# EAGLE design StasDuino_V2 (EAGLE 9.5.2)
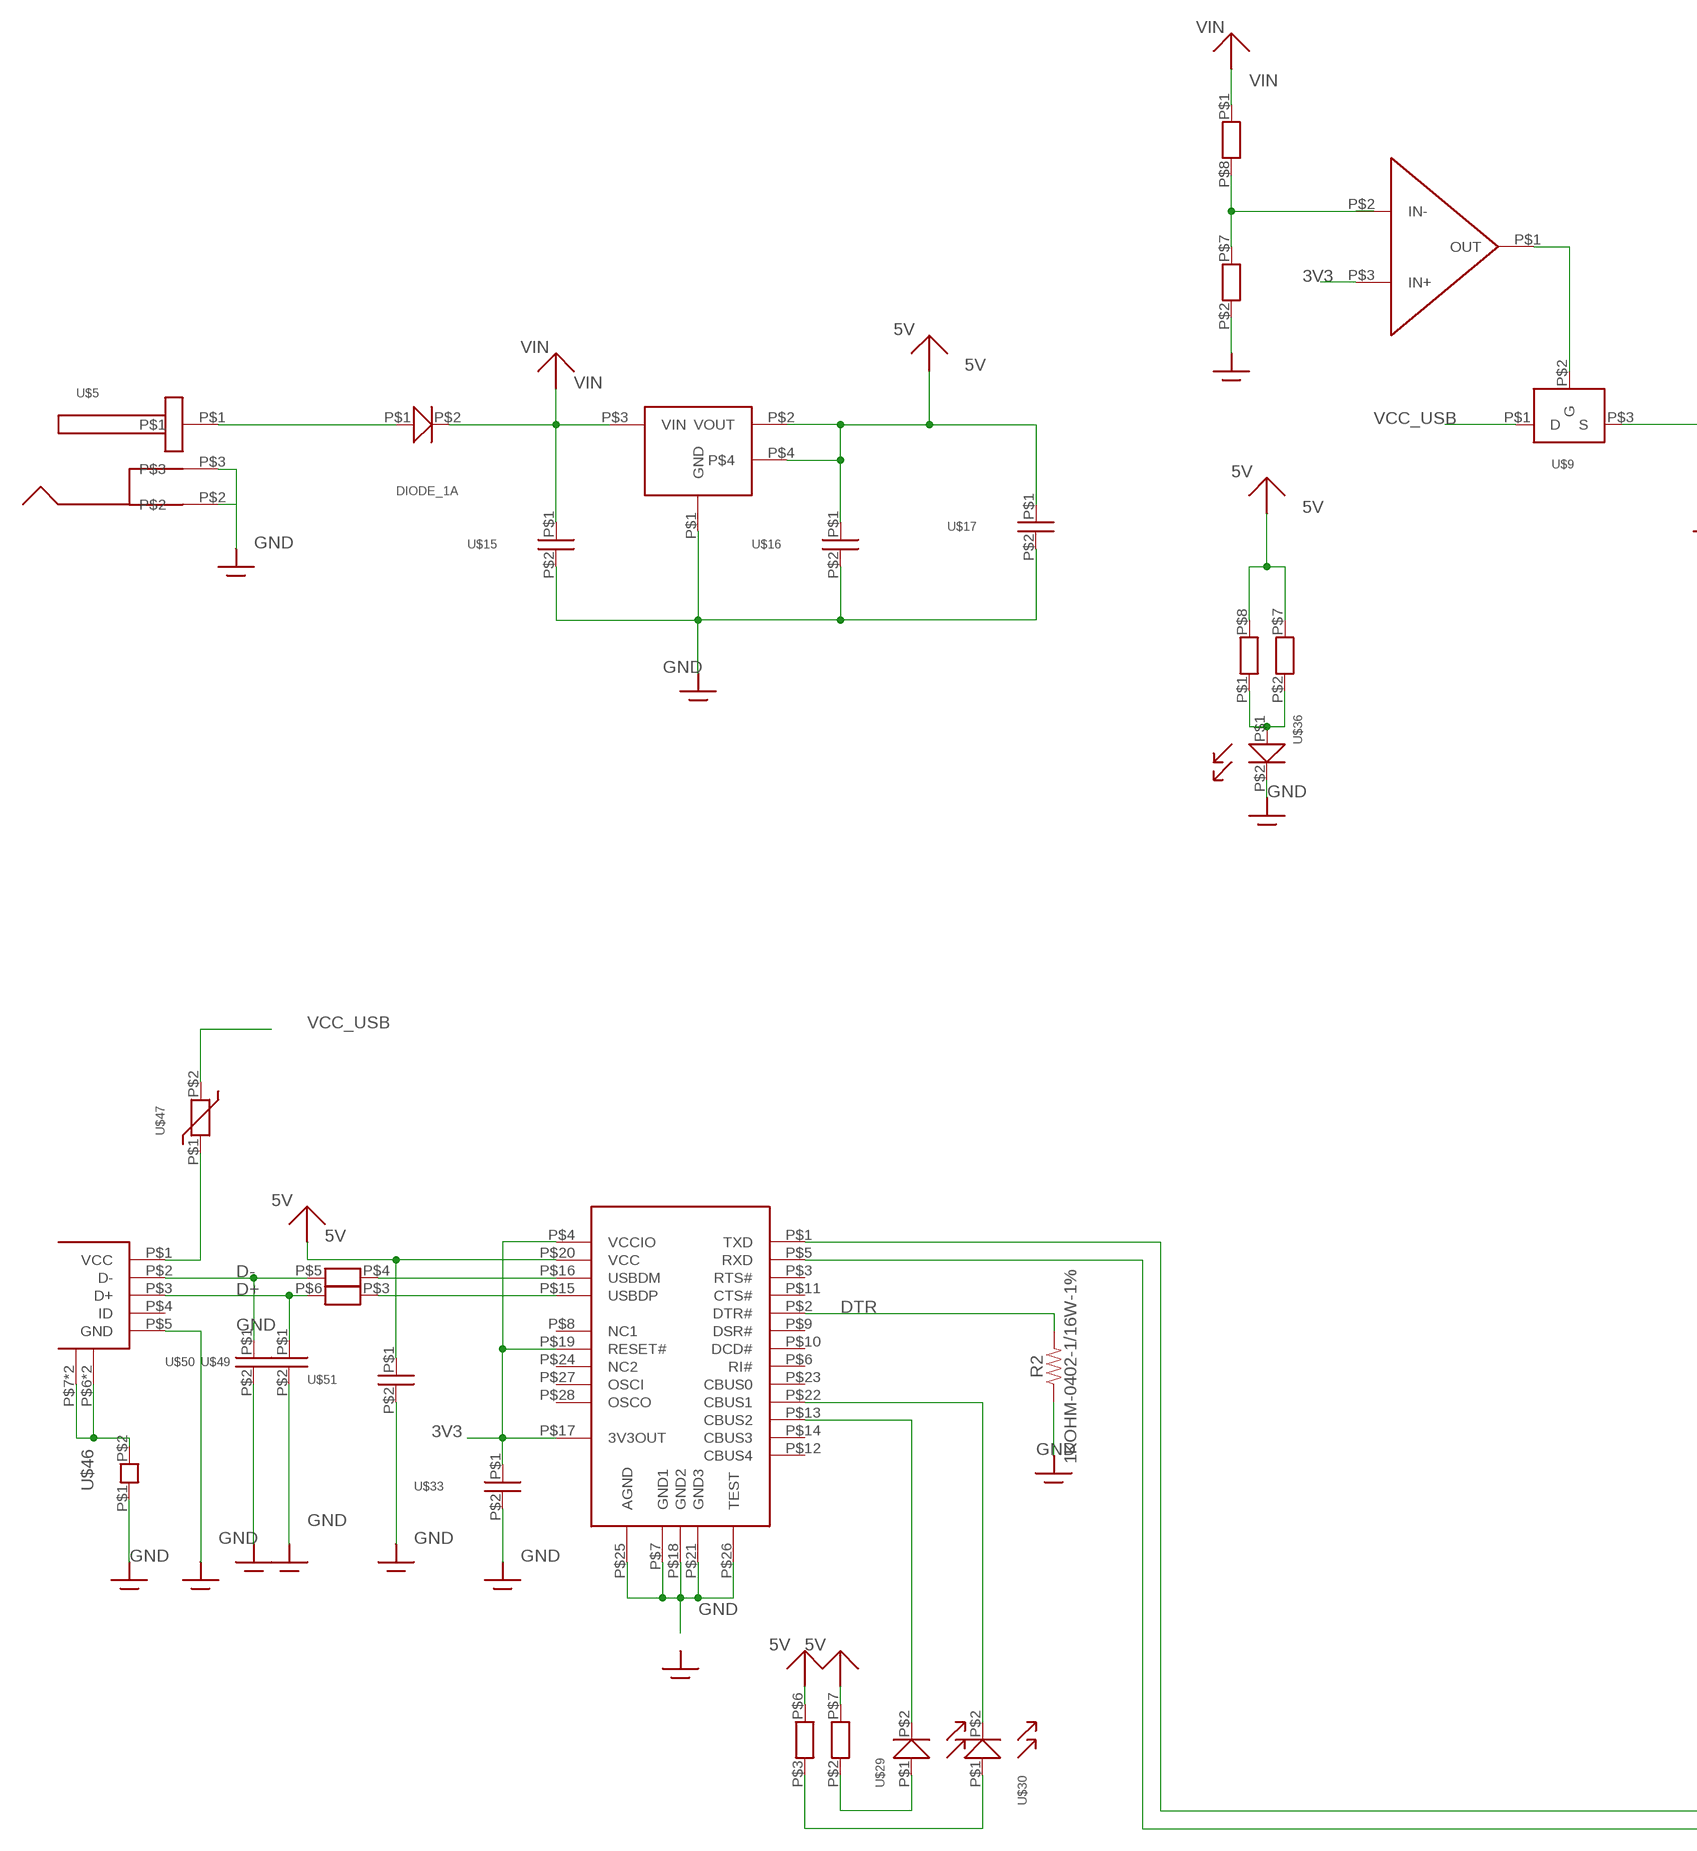
[diagram p0: schematic, sheet 1, part 1 of 2]
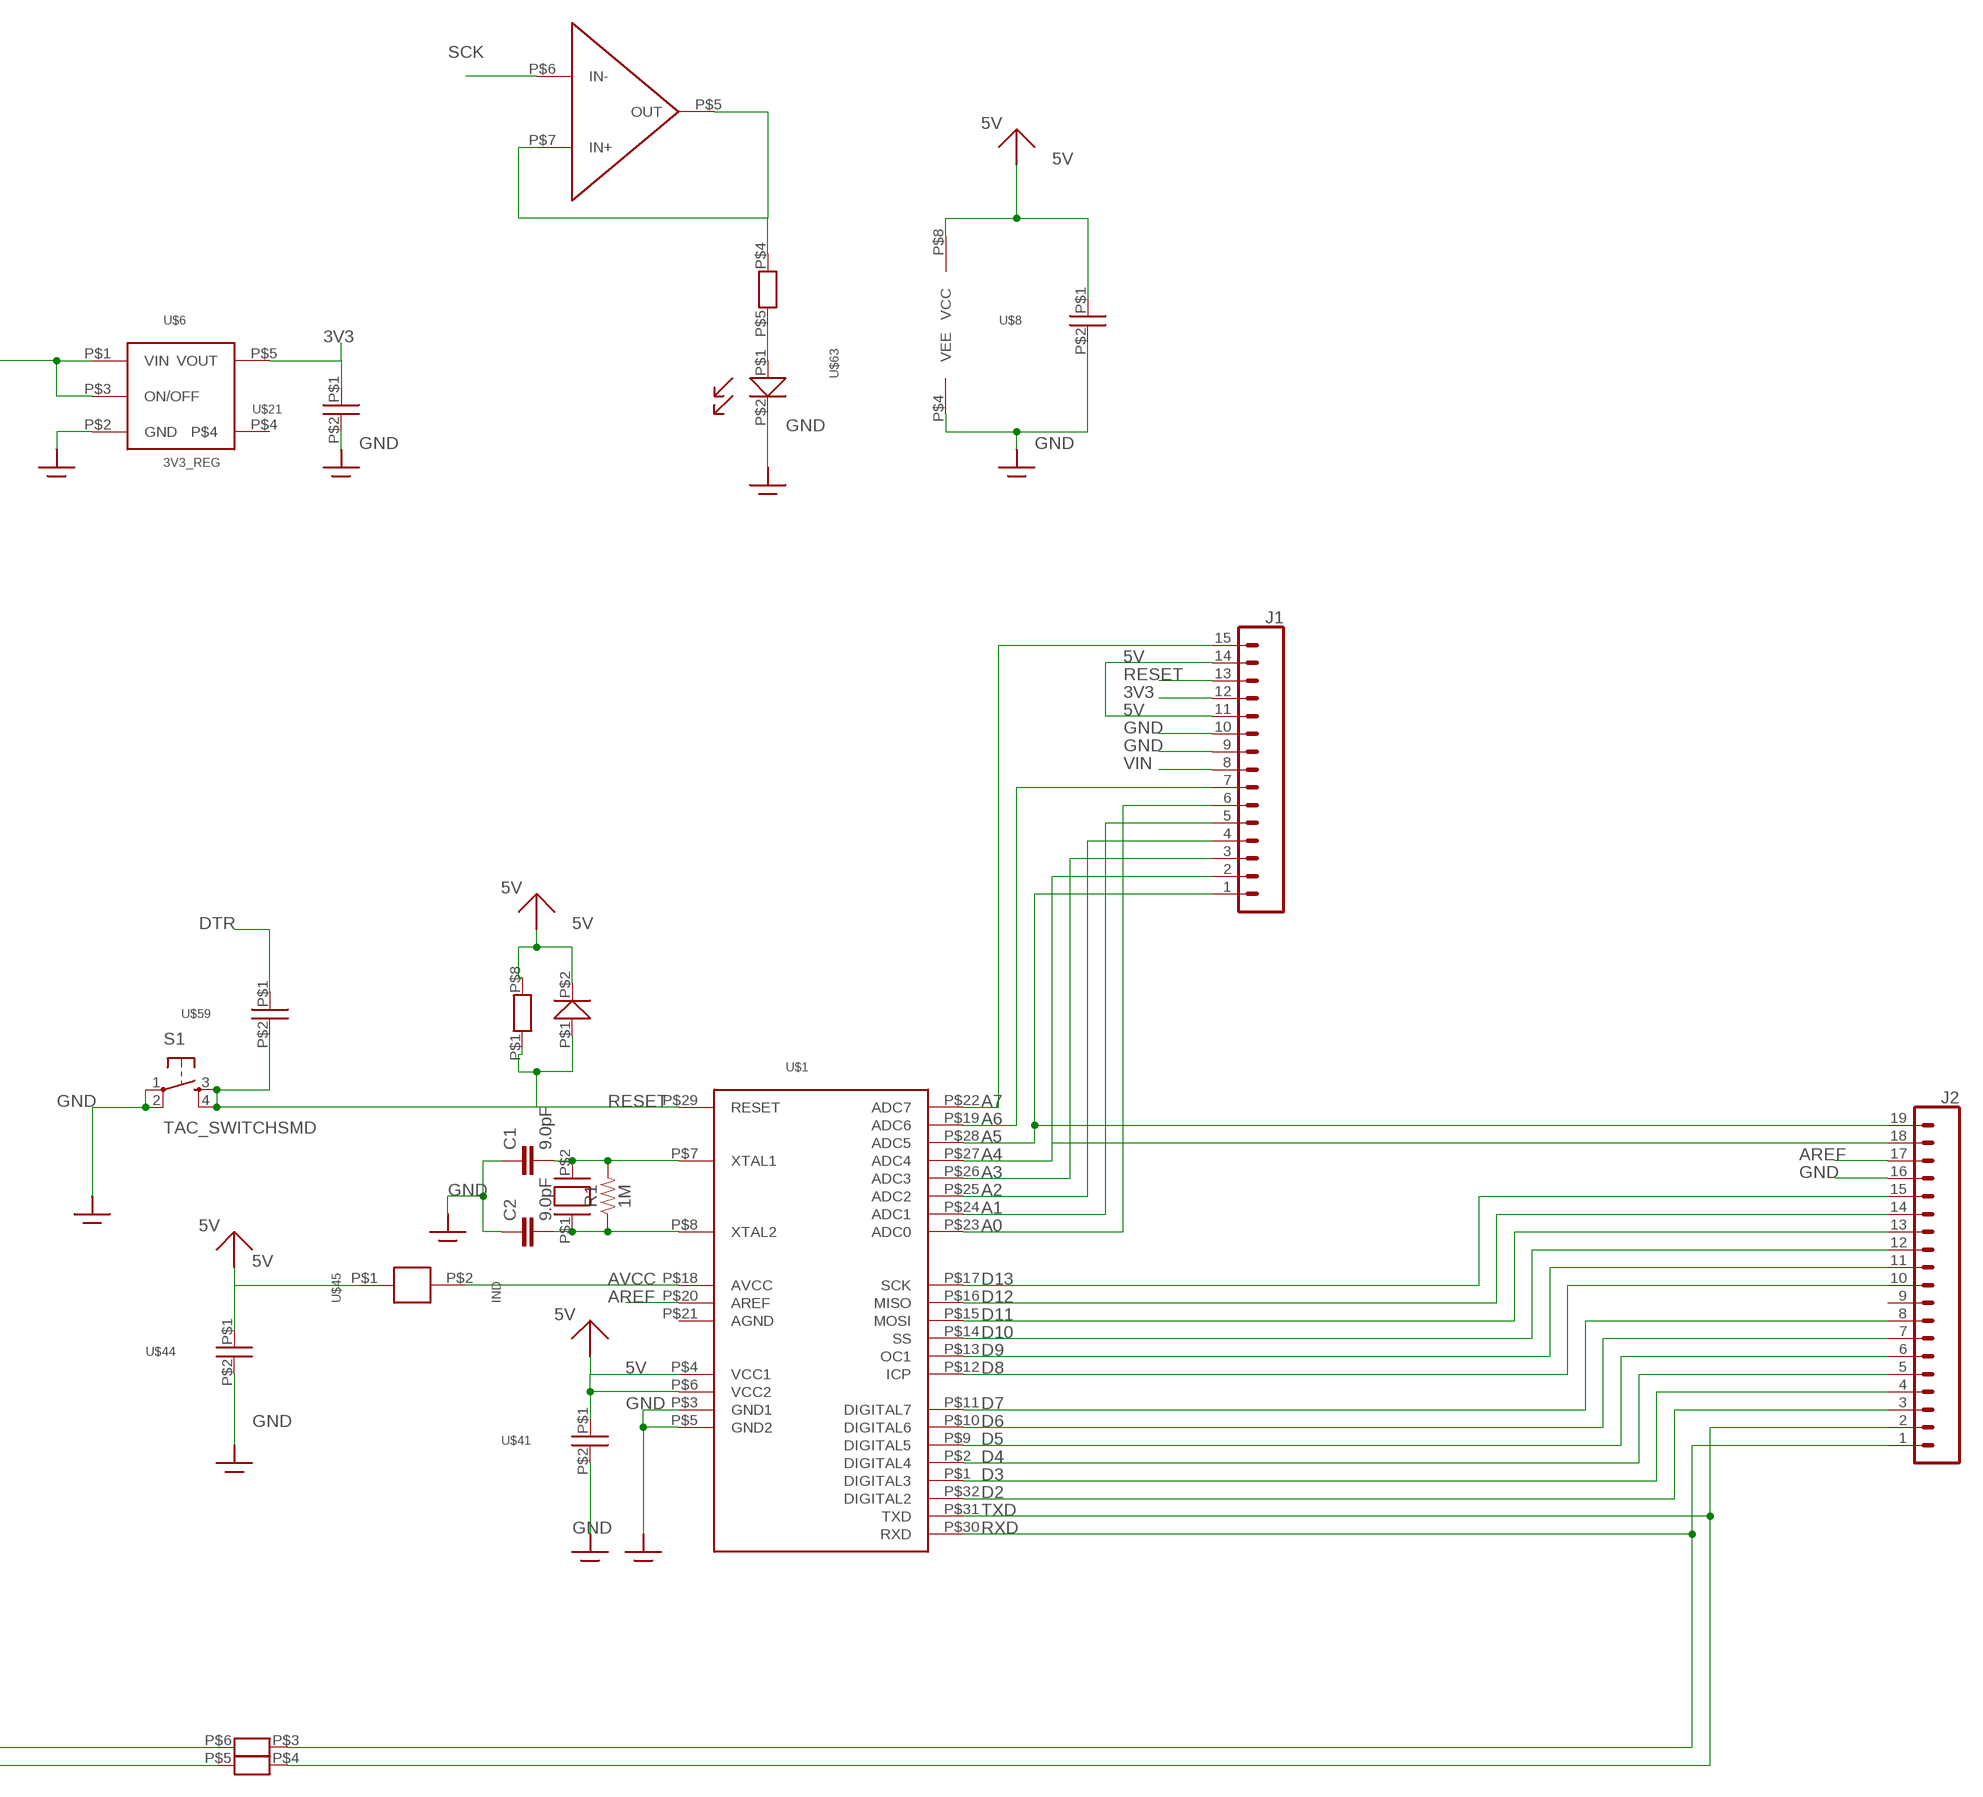
[diagram p1: schematic, sheet 1, part 2 of 2]

## Parts
C1  9.0pF  9.0PF-0603-50V-10%  [0603]
C2  9.0pF  9.0PF-0603-50V-10%  [0603]
J1  CONN_15  [1X15]
J2  CONN_19  [1X19]
R1  1M  1MOHM-0603-1/4W-5%  [0603]
R2  1KOHM-0402-1/16W-1%  [0402]
S1  TAC_SWITCHSMD  [TACTILE-SWITCH-SMD]
U$1  ATMEGA328P_TQFP  [ATMEGA328P_TQFP]
U$2  FTDI_SERIAL  [FTDI_SERIAL]
U$3  USB_MICRO  [USB_MICRO]
U$4  5V_REG  [5V_REG]
U$5  DC_POWERJACK  [DC_POWERJACK]
U$6  3V3_REG  [3V3_REG]
U$7  OPAMP  [OPAMP]
U$8  CAP_0805  [CAP_0805]
U$9  PMOS  [PMOS]
U$12  DIODE_1A  [DIODE_1A]
U$15  CAP_0805  [CAP_0805]
U$16  CAP_0805  [CAP_0805]
U$17  CAP_0805  [CAP_0805]
U$20  RES_ARRAY  [RES_ARRAY]
U$21  CAP_0805  [CAP_0805]
U$29  LED_0805  [LED_0805]
U$30  LED_0805  [LED_0805]
U$33  CAP_0805  [CAP_0805]
U$34  RES_ARRAY  [RES_ARRAY]
U$36  LED_0805  [LED_0805]
U$41  CAP_0805  [CAP_0805]
U$44  CAP_0805  [CAP_0805]
U$45  IND  [IND]
U$46  FERRITE_BEAD  [FERRITE_BEAD]
U$47  RESET_FUSE  [RESET_FUSE]
U$48  RES_ARRAY  [RES_ARRAY]
U$49  CAP_0805  [CAP_0805]
U$50  CAP_0805  [CAP_0805]
U$51  CAP_0805  [CAP_0805]
U$57  CRYSTAL  [CRYSTAL]
U$59  CAP_0805  [CAP_0805]
U$60  DIODE  [DIODE]
U$63  LED_0805  [LED_0805]

## Nets
3V3: J1.12 U$2.P$4(VCCIO) U$2.P$17(3V3OUT) U$2.P$19(RESET#) U$6.P$5(VOUT) U$7.P$3(IN+) U$21.P$1 U$33.P$1
5V: J1.11 J1.14 U$1.P$4(VCC1) U$1.P$6(VCC2) U$2.P$20(VCC) U$4.P$2(VOUT) U$4.P$4 U$7.P$8(VCC) U$8.P$1 U$16.P$1 U$17.P$1 U$34.P$7 U$34.P$8 U$41.P$1 U$44.P$1 U$45.P$1 U$48.P$6 U$48.P$7 U$48.P$8 U$51.P$1 U$60.P$2
A0: J1.6 U$1.P$23(ADC0)
A1: J1.5 U$1.P$24(ADC1)
A2: J1.4 U$1.P$25(ADC2)
A3: J1.3 U$1.P$26(ADC3)
A4: J1.2 J2.18 U$1.P$27(ADC4)
A5: J1.1 J2.19 U$1.P$28(ADC5)
A6: J1.7 U$1.P$19(ADC6)
A7: J1.15 U$1.P$22(ADC7)
AREF: J2.17 U$1.P$20(AREF)
AVCC: U$1.P$18(AVCC) U$45.P$2
D2: J2.3 U$1.P$32(DIGITAL2)
D3: J2.4 U$1.P$1(DIGITAL3)
D4: J2.5 U$1.P$2(DIGITAL4)
D5: J2.6 U$1.P$9(DIGITAL5)
D6: J2.7 U$1.P$10(DIGITAL6)
D7: J2.8 U$1.P$11(DIGITAL7)
D8: J2.10 U$1.P$12(ICP)
D9: J2.11 U$1.P$13(OC1)
D10: J2.12 U$1.P$14(SS)
D11: J2.13 U$1.P$15(MOSI)
D12: J2.14 U$1.P$16(MISO)
D13: J2.15 U$1.P$17(SCK)
D+: U$3.P$3(D+) U$20.P$6 U$49.P$1
D-: U$3.P$2(D-) U$20.P$5 U$50.P$1
DTR: R2.2 U$2.P$2(DTR#) U$59.P$1
GND: C1.1 C2.1 J1.9 J1.10 J2.16 R2.1 S1.1 S1.2 U$1.P$3(GND1) U$1.P$5(GND2) U$2.P$7(GND1) U$2.P$18(GND2) U$2.P$21(GND3) U$2.P$25(AGND) U$2.P$26(TEST) U$3.P$5(GND) U$4.P$1(GND) U$5.P$2 U$5.P$3 U$6.P$2(GND) U$7.P$4(VEE) U$8.P$2 U$15.P$2 U$16.P$2 U$17.P$2 U$20.P$2 U$21.P$2 U$33.P$2 U$36.P$2 U$41.P$2 U$44.P$2 U$46.P$1 U$49.P$2 U$50.P$2 U$51.P$2 U$63.P$2
N$1: C1.2 R1.2 U$1.P$7(XTAL1) U$57.P$2
N$2: U$5.P$1 U$12.P$1
N$3: U$3.P$6(SHIELD1) U$3.P$7(SHIELD2) U$3.P$8(SHIELD1) U$3.P$9(SHIELD2) U$46.P$2
N$4: C2.2 R1.1 U$1.P$8(XTAL2) U$57.P$1
N$5: U$7.P$2(IN-) U$20.P$7 U$20.P$8
N$6: U$7.P$1(OUT) U$9.P$2(G)
N$7: U$29.P$1 U$48.P$2
N$8: U$6.P$1(VIN) U$6.P$3(ON/OFF) U$9.P$3(S)
N$9: U$30.P$1 U$48.P$3
N$10: U$48.P$5 U$63.P$1
N$11: U$2.P$15(USBDP) U$20.P$3
N$12: U$2.P$5(RXD) U$34.P$5
N$13: U$2.P$1(TXD) U$34.P$6
N$14: U$2.P$22(CBUS1) U$30.P$2
N$15: U$2.P$16(USBDM) U$20.P$4
N$16: U$2.P$13(CBUS2) U$29.P$2
N$24: U$34.P$1 U$34.P$2 U$36.P$1
N$32: U$3.P$1(VCC) U$47.P$1
N$60: U$7.P$5(OUT) U$7.P$7(IN+) U$48.P$4
RESET: J1.13 S1.3 S1.4 U$1.P$29(RESET) U$48.P$1 U$59.P$2 U$60.P$1
RXD: J2.1 U$1.P$30(RXD) U$34.P$3
SCK: U$7.P$6(IN-)
TXD: J2.2 U$1.P$31(TXD) U$34.P$4
VCC_USB: U$9.P$1(D) U$47.P$2
VIN: J1.8 U$4.P$3(VIN) U$12.P$2 U$15.P$1 U$20.P$1
Unconnected: J2.9 U$1.P$21(AGND) U$2.P$3(RTS#) U$2.P$6(RI#) U$2.P$8(NC1) U$2.P$9(DSR#) U$2.P$10(DCD#) U$2.P$11(CTS#) U$2.P$12(CBUS4) U$2.P$14(CBUS3) U$2.P$23(CBUS0) U$2.P$24(NC2) U$2.P$27(OSCI) U$2.P$28(OSCO) U$3.P$4(ID) U$6.P$4

## Library data of the parts
C1 C2 = StasDuinoLib2:9.0PF: 9.0pF ceramic capacitors A capacitor is a passive two-terminal electrical component used to store electrical energy temporarily in an electric field.; PROD_ID: CAP-09341
J1 = StasDuinoLib2:CONN_15: Multi connection point. Often used as Generic Header-pin footprint for 0.1 inch spaced/style header connections On any of the 0.1 inch spaced packages, you can populate with these: Break Away Headers - Straight <https://www.sparkfun.com/products/116> (PRT-00116) Break Away Male Headers - Right Angle <https://www.sparkfun.com/products/553> (PRT-00553) Female Headers <https://www.sparkfun.com/products/115> (PRT-00115) Break Away Headers - Machine Pin <https://www.sparkfun.com/products/117> (PRT-00117) Break Away Female Headers - Swiss Machine Pin <https://www.sparkfun.com/products/743> (PRT-00743) For SCREWTERMINALS and SPRING TERMINALS visit here: Screw Terimnals on SparkFun.com <https://www.sparkfun.com/search/results?term=Screw+Terminals> (5mm/3.5mm/2.54mm spacing) This device is also useful as a general connection point to wire up your design to another part of your project. Our various solder wires solder well into these plated through hole pads. Hook-Up Wire - Assortment (Stranded, 22 AWG) <https://www.sparkfun.com/products/11375> (PRT-11375) Hook-Up Wire - Assortment (Solid Core, 22 AWG) <https://www.sparkfun.com/products/11367> (PRT-11367) View the entire wire category on our website here <https://www.sparkfun.com/categories/141> Special notes: Molex polarized connector foot print use with SKU : PRT-08231 with associated crimp pins and housings. 1MM SMD Version SKU: PRT-10208 NOTES ON THE VARIANTS LOCK and LOCK_LONGPADS... This footprint was designed to help hold the alignment of a through-hole component (i.e. 6-pin header) while soldering it into place. You may notice that each hole has been shifted either up or down by 0.005 of an inch from it's more standard position (which is a perfectly straight line). This slight alteration caused the pins (the squares in the middle) to touch the edges of the holes. Because they are alternating, it causes a "brace" to hold the component in place. 0.005 has proven to be the perfect amount of "off-center" position when using our standard breakaway headers. Although looks a little odd when you look at the bare footprint, once you have a header in there, the alteration is very hard to notice. Also,if you push a header all the way into place, it is covered up entirely on the bottom side.
J2 = StasDuinoLib2:CONN_19: Multi connection point. Often used as Generic Header-pin footprint for 0.1 inch spaced/style header connections On any of the 0.1 inch spaced packages, you can populate with these: Break Away Headers - Straight <https://www.sparkfun.com/products/116> (PRT-00116) Break Away Male Headers - Right Angle <https://www.sparkfun.com/products/553> (PRT-00553) Female Headers <https://www.sparkfun.com/products/115> (PRT-00115) Break Away Headers - Machine Pin <https://www.sparkfun.com/products/117> (PRT-00117) Break Away Female Headers - Swiss Machine Pin <https://www.sparkfun.com/products/743> (PRT-00743) For SCREWTERMINALS and SPRING TERMINALS visit here: Screw Terimnals on SparkFun.com <https://www.sparkfun.com/search/results?term=Screw+Terminals> (5mm/3.5mm/2.54mm spacing) This device is also useful as a general connection point to wire up your design to another part of your project. Our various solder wires solder well into these plated through hole pads. Hook-Up Wire - Assortment (Stranded, 22 AWG) <https://www.sparkfun.com/products/11375> (PRT-11375) Hook-Up Wire - Assortment (Solid Core, 22 AWG) <https://www.sparkfun.com/products/11367> (PRT-11367) View the entire wire category on our website here <https://www.sparkfun.com/categories/141> Special notes: Molex polarized connector foot print use with SKU : PRT-08231 with associated crimp pins and housings. 1MM SMD Version SKU: PRT-10208 NOTES ON THE VARIANTS LOCK and LOCK_LONGPADS... This footprint was designed to help hold the alignment of a through-hole component (i.e. 6-pin header) while soldering it into place. You may notice that each hole has been shifted either up or down by 0.005 of an inch from it's more standard position (which is a perfectly straight line). This slight alteration caused the pins (the squares in the middle) to touch the edges of the holes. Because they are alternating, it causes a "brace" to hold the component in place. 0.005 has proven to be the perfect amount of "off-center" position when using our standard breakaway headers. Although looks a little odd when you look at the bare footprint, once you have a header in there, the alteration is very hard to notice. Also,if you push a header all the way into place, it is covered up entirely on the bottom side.
R1 = StasDuinoLib2:1MOHM: 1MΩ resistor A resistor is a passive two-terminal electrical component that implements electrical resistance as a circuit element. Resistors act to reduce current flow, and, at the same time, act to lower voltage levels within circuits. - Wikipedia; PROD_ID: RES-07868
R2 = StasDuinoLib2:1KOHM: 1kΩ resistor A resistor is a passive two-terminal electrical component that implements electrical resistance as a circuit element. Resistors act to reduce current flow, and, at the same time, act to lower voltage levels within circuits. - Wikipedia; PROD_ID: RES-14342
S1 = StasDuinoLib2:TAC_SWITCH: Momentary Switch Button commonly used for reset or general input. Spark Fun Electronics SKU : COM-00097 SMT- SWCH-08247; PROD_ID: SWCH-08247
U$1 = StasDuinoLib2:ATMEGA328P_TQFP
U$2 = StasDuinoLib2:FTDI_SERIAL
U$3 = StasDuinoLib2:USB_MICRO
U$4 = StasDuinoLib2:5V_REG
U$5 = StasDuinoLib2:DC_POWERJACK
U$6 = StasDuinoLib2:3V3_REG
U$7 = StasDuinoLib2:OPAMP
U$8 U$15-U$17 U$21 U$33 U$41 U$44 U$49-U$51 U$59 = StasDuinoLib2:CAP_0805
U$9 = StasDuinoLib2:PMOS
U$12 = StasDuinoLib2:DIODE_1A
U$20 U$34 U$48 = StasDuinoLib2:RES_ARRAY
U$29 U$30 U$36 U$63 = StasDuinoLib2:LED_0805
U$45 = StasDuinoLib2:IND
U$46 = StasDuinoLib2:FERRITE_BEAD
U$47 = StasDuinoLib2:RESET_FUSE
U$57 = StasDuinoLib2:CRYSTAL
U$60 = StasDuinoLib2:DIODE

## Board
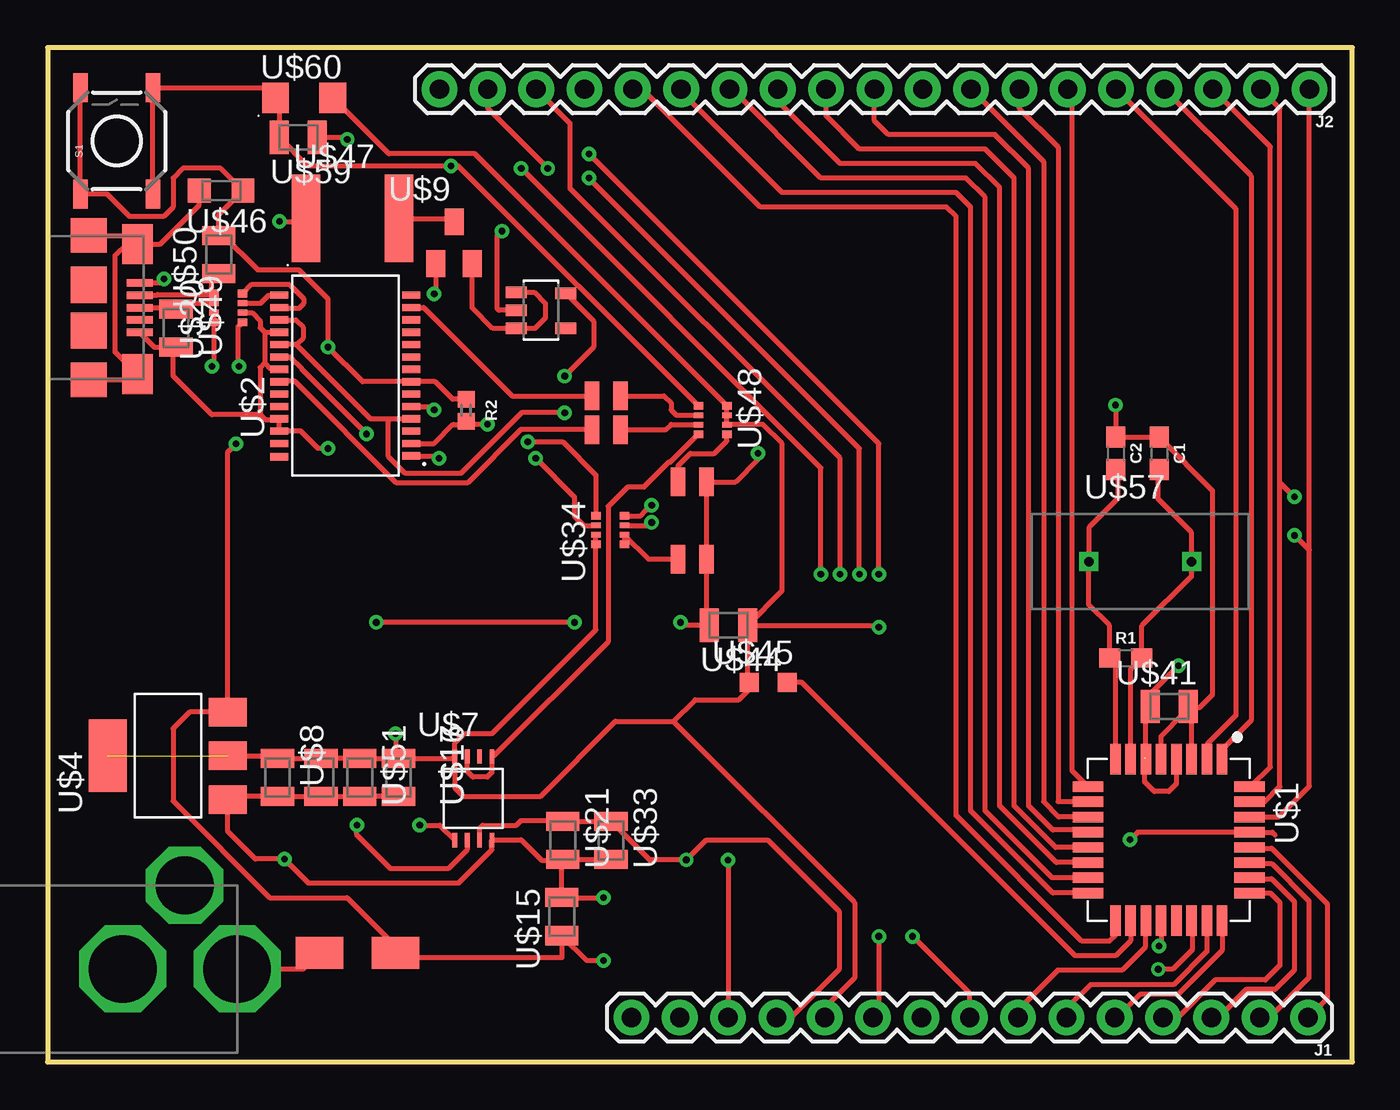
[diagram p2: board, top side]
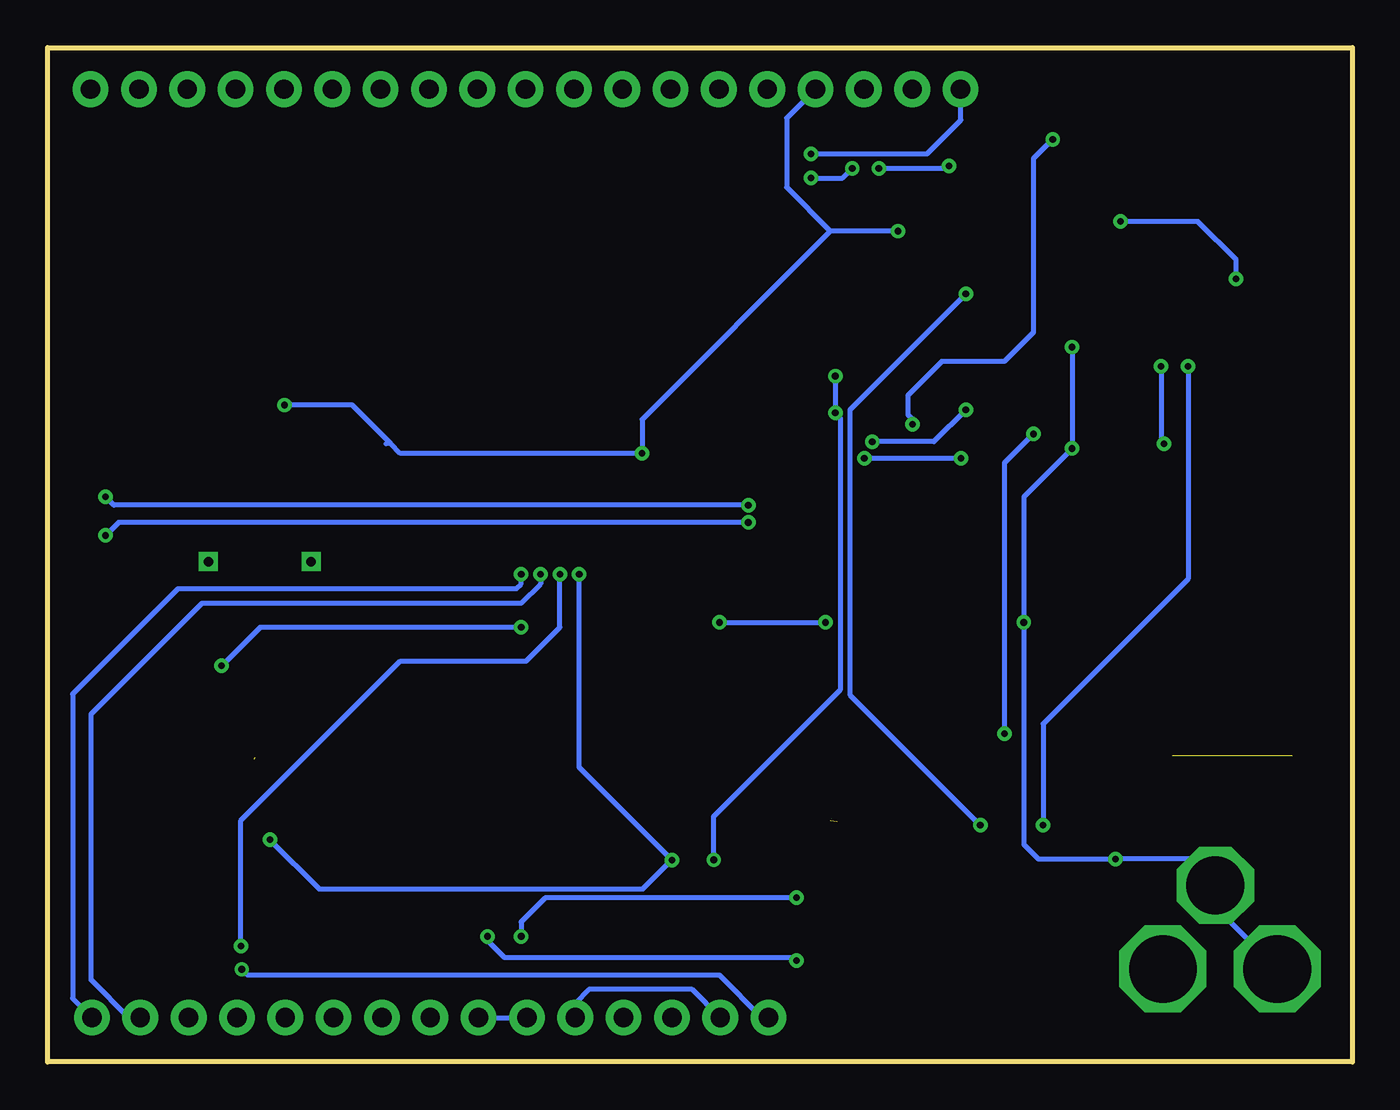
[diagram p3: board, bottom side, seen from below]

Size 68.58 x 53.34 mm. Coordinates in mm from the lower left corner, seen from the top.
Outline: 0,0 68.58,0 68.58,53.34 0,53.34 0,0
Copper layers (1*16): Top 0.035mm / dielectric 1.5mm / Bottom 0.035mm
Design rules "default": minimum track width 6mil, minimum drill 0.35mm, track to track 6mil, track to pad 6mil, pad to pad 6mil, via to via 6mil, smd to smd 6mil, copper to edge 40mil, drill to drill 6mil, minimum pad ring 10mil, minimum via ring 8mil, stop-mask expansion 4mil, vias tented up to drill 0mil, thermal gap 10mil

### Footprints (pad centres in the part's own frame; a part is rotated, then mirrored left to right if it is on the bottom)
0603 = smd 1.1 x 1: 1 -0.85,0; 2 0.85,0
1X15 = drill 1.016 pad 1.88: 1 0,0; 2 2.54,0; 3 5.08,0; 4 7.62,0; 5 10.16,0; 6 12.7,0; 7 15.24,0; 8 17.78,0; 9 20.32,0; 10 22.86,0; 11 25.4,0; 12 27.94,0; 13 30.48,0; 14 33.02,0; 15 35.56,0
1X19 = drill 1.016 pad 1.88: 1 0,0; 2 2.54,0; 3 5.08,0; 4 7.62,0; 5 10.16,0; 6 12.7,0; 7 15.24,0; 8 17.78,0; 9 20.32,0; 10 22.86,0; 11 25.4,0; 12 27.94,0; 13 30.48,0; 14 33.02,0; 15 35.56,0; 16 38.1,0; 17 40.64,0; 18 43.18,0; 19 45.72,0
0402 = smd 0.85 x 0.9: 1 -0.58,0; 2 0.58,0
TACTILE-SWITCH-SMD = smd 1.524 x 0.762: 1 -2.794,1.905; 2 2.794,1.905; 3 -2.794,-1.905; 4 2.794,-1.905
ATMEGA328P_TQFP = smd 1.6 x 0.55: P$1 -4.25,2.8; P$2 -4.25,2; P$3 -4.25,1.2; P$4 -4.25,0.4; P$5 -4.25,-0.4; P$6 -4.25,-1.2; P$7 -4.25,-2; P$8 -4.25,-2.8; P$17 4.25,-2.8; P$18 4.25,-2; P$19 4.25,-1.2; P$20 4.25,-0.4; P$21 4.25,0.4; P$22 4.25,1.2; P$23 4.25,2; P$24 4.25,2.8 | smd 0.55 x 1.6: P$9 -2.8,-4.25; P$10 -2,-4.25; P$11 -1.2,-4.25; P$12 -0.4,-4.25; P$13 0.4,-4.25; P$14 1.2,-4.25; P$15 2,-4.25; P$16 2.8,-4.25; P$25 2.8,4.25; P$26 2,4.25; P$27 1.2,4.25; P$28 0.4,4.25; P$29 -0.4,4.25; P$30 -1.2,4.25; P$31 -2,4.25; P$32 -2.8,4.25
FTDI_SERIAL = smd 0.38 x 0.95: P$1 -4.225,-3.475; P$2 -3.575,-3.475; P$3 -2.925,-3.475; P$4 -2.275,-3.475; P$5 -1.625,-3.475; P$6 -0.975,-3.475; P$7 -0.325,-3.475; P$8 0.325,-3.475; P$9 0.975,-3.475; P$10 1.625,-3.475; P$11 2.275,-3.475; P$12 2.925,-3.475; P$13 3.575,-3.475; P$14 4.225,-3.475; P$15 4.225,3.475; P$16 3.575,3.475; P$17 2.925,3.475; P$18 2.275,3.475; P$19 1.625,3.475; P$20 0.975,3.475; P$21 0.325,3.475; P$22 -0.325,3.475; P$23 -0.975,3.475; P$24 -1.625,3.475; P$25 -2.275,3.475; P$26 -2.925,3.475; P$27 -3.575,3.475; P$28 -4.275,3.475
USB_MICRO = smd 0.4 x 1.35: P$1 -1.3,-0.675; P$2 -0.65,-0.675; P$3 0,-0.675; P$4 0.65,-0.675; P$5 1.3,-0.675 | smd 2.1 x 1.6: P$6 -3.35,-0.8; P$7 3.5,-0.8 | smd 1.8 x 1.9: P$8 -3.8,-3.35; P$9 3.8,-3.35 | smd 1.9 x 1.9: P$10 -1.2,-3.35; P$11 1.2,-3.35
5V_REG = smd 1.5 x 2: P$1 -2.3,-3.15; P$2 0,-3.15; P$3 2.3,-3.15 | smd 3.8 x 2: P$4 0,3.15
DC_POWERJACK = drill 3.56 octagon: P$1 0,-6.75; P$2 0,-0.74 | drill 3.05 octagon: P$3 4.4,-3.99
3V3_REG = smd 1.1 x 0.6: P$1 -1.3,0.95; P$2 -1.3,0; P$3 -1.3,-0.95; P$4 1.3,-0.95; P$5 1.3,0.9
OPAMP = smd 0.25 x 0.75: P$1 -0.975,-2.2; P$2 -0.325,-2.2; P$3 0.325,-2.2; P$4 0.975,-2.2; P$5 0.975,2.2; P$6 0.325,2.2; P$7 -0.325,2.2; P$8 -0.975,2.2
CAP_0805 = smd 1 x 1.75: P$1 -1,0; P$2 1,0
PMOS = smd 1 x 1.4: P$1 0,1.1; P$2 -0.95,-1.1; P$3 0.95,-1.1
DIODE_1A = smd 2.5 x 1.7: P$1 -2,0; P$2 2,0
RES_ARRAY = smd 0.4 x 0.5: P$1 -0.75,-0.75; P$4 0.75,-0.75; P$5 0.75,0.75; P$8 -0.75,0.75 | smd 0.3 x 0.5: P$2 -0.25,-0.75; P$3 0.25,-0.75; P$6 0.25,0.75; P$7 -0.25,0.75
LED_0805 = smd 1.5 x 0.75: P$1 0,0.75; P$2 0,-0.75
IND = smd 1 x 1: P$1 -1,0; P$2 1,0
FERRITE_BEAD = smd 1.2 x 1.25: P$1 -1.15,0; P$2 1.15,0
RESET_FUSE = smd 1.5 x 4.6: P$1 -2.45,0; P$2 2.45,0
CRYSTAL = drill 0.5 square: P$1 -2.7,0; P$2 2.7,0
DIODE = smd 1.4 x 1.6: P$1 -1.5,0; P$2 1.5,0

### Placement (x,y rotation side)
C1  58.42,32 270 top
C2  56.13,32 270 top
J1  66.25,2.33 180 top
J2  66.32,51.15 180 top
R1  56.67,21.23 0 top
R2  22,34.26 270 top
S1  3.63,48.43 90 top
U$1  58.93,11.68 270 top
U$2  15.65,36.09 90 top
U$3  5.51,39.66 270 top
U$4  6.32,16.1 90 top
U$5  3.21,4.89 90 top
U$6  25.93,39.52 0 top
U$7  22.38,13.87 0 top
U$8  12.09,14.96 270 top
U$9  21.36,43.08 0 top
U$12  16.28,5.74 0 top
U$15  27.03,7.65 90 top
U$16  18.44,14.96 270 top
U$17  14.38,14.96 270 top
U$20  9.5,39.65 90 top
U$21  27.08,11.66 270 top
U$29  29.36,35.03 270 top
U$30  29.36,33.25 270 top
U$33  29.62,11.66 270 top
U$34  29.57,27.97 90 top
U$36  33.88,26.44 90 top
U$41  58.95,18.69 0 top
U$44  35.79,22.96 180 top
U$45  37.87,19.96 0 top
U$46  9.12,45.82 180 top
U$47  16.03,44.35 0 top
U$48  34.95,33.76 270 top
U$49  6.76,38.58 270 top
U$50  8.99,42.44 90 top
U$51  16.41,14.96 270 top
U$57  57.43,26.31 0 top
U$59  13.18,48.62 180 top
U$60  13.49,50.7 0 top
U$63  33.88,30.51 90 top

### Tracks (layer width: path | path; a pad name or v marks a point on that pad's centre or on a via)
3V3  (via drill 0.35)  (1 unrouted)
  Top 0.254: U$2.P$17 13.05,39.02 13.46,38.61 13.46,38.1 13.08,37.72 | 13.08,37.72 U$2.P$19 | U$2.P$4 17.78,33.82 | 17.78,33.82 16.98,33.82 13.08,37.72 | U$7.P$3 22.7,12.29 22.86,12.45 24.64,12.45 24.89,12.7 27.43,12.7 | U$21.P$1 U$33.P$1 31.65,10.63 v33.57,10.63 34.59,11.64 37.89,11.64 41.61,7.92 41.61,4.87 39.07,2.33 J1.12 | v27.18,34.13 24.91,34.13 21.72,30.94 18.81,30.94 17.91,31.84 17.91,33.69 17.78,33.82 | U$6.P$5 28.7,38.95 28.7,37.59 v27.18,36.07
  Bottom 0.254: v33.57,10.63 33.57,12.91 26.92,19.56 26.92,33.88 v27.18,34.13 v27.18,36.07
5V  (via drill 0.35)  (2 unrouted)
  Top 0.254: 21.37,16.1 U$7.P$8 | 12.49,37.09 12.2,37.09 U$2.P$20 12.76,37.07 13.38,36.45 13.38,36.4 v16.76,33.02 | U$48.P$6 35.7,33.53 | 35.7,33.53 U$48.P$7 U$48.P$8 22.45,47.75 17.93,47.75 U$60.P$2 | U$4.P$2 11.95,16.1 U$8.P$1 U$17.P$1 U$51.P$1 18.29,15.96 | 18.29,15.96 U$16.P$1 21.3,15.96 U$7.P$8 | 32.89,17.91 42.42,8.38 42.42,4.41 40.85,2.84 J1.11 | v18.29,17.27 18.29,15.96 | U$34.P$7 U$34.P$8 28.82,22.72 23.37,17.27 21.91,17.27 21.4,16.76 U$7.P$8 | U$45.P$1 36.62,19.96 | U$1.P$6 57.73,18.47 U$41.P$1 57.95,19.35 v59.44,20.83 | U$1.P$4 59.33,14.62 58.93,14.22 58.17,14.22 57.66,14.73 57.66,16 | 32.89,17.91 34.04,19.05 36.32,19.05 36.87,19.6 U$45.P$1 | U$7.P$8 21.4,14.41 21.84,13.97 25.91,13.97 29.84,17.91 32.89,17.91 | U$45.P$1 36.79,20.05 U$44.P$1 | U$44.P$1 43.59,22.96 v43.69,22.86 | U$44.P$1 38.61,24.78 38.61,32.51 37.59,33.53 35.7,33.53
  Bottom 0.254: J1.14 34.7,3.81 40.13,3.81 40.85,3.1 J1.11 | v16.76,33.02 18.29,31.5 v18.29,17.27 | v43.69,22.86 57.4,22.86 v59.44,20.83
A0
  Top 0.254: U$1.P$23 60.93,5.81 59.18,4.06 54.82,4.06 53.55,2.79 J1.6
A1
  Top 0.254: J1.5 56.18,2.33 57.4,3.56 59.42,3.56 61.73,5.87 U$1.P$24
A2
  Top 0.254: U$1.P$25 64.27,8.88 64.77,8.38 64.77,5.08 64.01,4.32 61.37,4.32 59.39,2.33 J1.4
A3
  Top 0.254: U$1.P$26 63.22,9.64 64.33,9.64 65.53,8.44 65.53,4.83 64.52,3.81 62.99,3.81 61.52,2.33 J1.3
A4  (via drill 0.35)
  Top 0.254: U$1.P$27 63.22,10.44 64.33,10.44 66.29,8.47 66.29,4.41 64.21,2.33 J1.2 | v42.67,25.65 42.67,32.26 v28.45,46.48 | v26.29,46.99 23.14,50.14 J2.18
  Bottom 0.254: J1.2 64.31,2.33 66.29,4.32 66.29,18.29 60.45,24.13 43.69,24.13 42.67,25.15 v42.67,25.65 | v28.45,46.48 26.8,46.48 v26.29,46.99
A5  (via drill 0.35)
  Top 0.254: U$1.P$28 63.22,11.24 64.33,11.24 67.26,8.31 67.26,3.35 J1.1 | v43.69,25.65 43.69,32.51 v28.45,47.75
  Bottom 0.254: J1.1 67.26,3.35 67.26,19.35 61.72,24.89 43.94,24.89 43.69,25.15 v43.69,25.65 | v28.45,47.75 22.35,47.75 20.57,49.53 20.57,51.13 J2.19
A6
  Top 0.254: U$1.P$19 57.69,7.39 57.69,6.03 56.48,4.83 53.09,4.83 51.01,2.75 J1.7
A7  (via drill 0.35)
  Top 0.254: U$1.P$22 60.15,7.41 60.15,5.89 59.13,4.87 v58.37,4.87
  Bottom 0.254: v58.37,4.87 58.07,4.57 33.27,4.57 31.04,2.33 J1.15
AREF  (via drill 0.35)
  Top 0.254: U$1.P$20 58.53,6.2 v58.42,6.1 | v41.66,25.65 41.66,31.75 27.46,45.95 27.46,49.37 J2.17
  Bottom 0.254: v58.42,6.1 58.42,12.7 50.04,21.08 43.43,21.08 41.66,22.86 v41.66,25.65
AVCC
  Top 0.254: U$1.P$18 56.93,6.38 56.13,5.59 54.01,5.59 39.63,19.96 U$45.P$2
D2
  Top 0.254: J2.3 64.26,48.13 64.26,15.5 63.25,14.48 U$1.P$32
D3
  Top 0.254: U$1.P$1 61.73,16.44 63.25,17.97 63.25,46.6 J2.4
D4
  Top 0.254: U$1.P$2 60.93,16.7 62.45,18.22 62.45,44.86 J2.5
D5
  Top 0.254: U$1.P$9 53.85,15.31 53.85,50.92 J2.6
D6
  Top 0.254: U$1.P$10 53.12,13.68 53.11,13.69 53.11,48.1 51.08,50.13 J2.7
D7
  Top 0.254: U$1.P$11 53.16,12.88 52.35,13.69 52.35,47.34 J2.8
D8
  Top 0.254: U$1.P$12 54.57,12.19 52.83,12.19 51.56,13.46 51.56,46.99 49.78,48.77 44.2,48.77 43.46,49.51 J2.10
D9
  Top 0.254: U$1.P$13 52.98,11.28 50.8,13.46 50.8,46.48 49.28,48.01 42.67,48.01 40.92,49.76 J2.11
D10
  Top 0.254: U$1.P$14 53.02,10.48 50.04,13.46 50.04,45.97 48.77,47.24 41.66,47.24 38.38,50.52 J2.12
D11
  Top 0.254: U$1.P$15 52.8,9.68 49.28,13.21 49.28,45.47 48.26,46.48 40.64,46.48 35.97,51.15 J2.13
D12
  Top 0.254: U$1.P$16 52.84,8.88 48.51,13.21 48.51,44.96 47.75,45.72 38.61,45.72 33.3,51.03 J2.14
D13
  Top 0.254: U$1.P$17 56.13,6.67 55.81,6.35 54.36,6.35 47.75,12.95 47.75,44.45 47.24,44.96 37.46,44.96 31.27,51.15 J2.15
D+
  Top 0.254: 5.42,39.66 U$3.P$3 6.68,39.66 U$49.P$1 7.07,39.9 U$20.P$6
D-
  Top 0.254: 4.93,40.4 U$3.P$2 5.72,40.31 5.76,40.36 8.71,40.36 U$20.P$5 8.64,40.51 8.64,41.44 | 8.64,41.44 8.51,41.44 8.5,41.46 | 8.64,41.44 U$50.P$1
DTR  (via drill 0.35)
  Top 0.254: U$2.P$2 20.32,32.52 21.33,33.53 21.34,33.53 21.84,33.53 | 21.84,33.53 R2.2 | U$59.P$1 15.65,48.62 v15.75,48.51 | v23.11,33.53 21.84,33.53
  Bottom 0.254: v15.75,48.51 16.76,47.5 16.76,38.35 18.29,36.83 21.59,36.83 23.37,35.05 23.37,34.04 23.11,33.78 v23.11,33.53
GND  (via drill 0.35)
  Top 0.254: S1.2 S1.1 3.14,45.63 4.32,44.45 6.1,44.45 6.6,44.96 6.6,46.48 7.11,46.99 9.1,46.99 U$46.P$1 8.99,44.55 U$50.P$2 9.25,43.44 11.03,41.66 13.21,41.66 14.73,40.13 v14.73,37.59 16.56,35.77 U$2.P$7 20.37,35.77 21.29,34.84 R2.1 | 27.03,10.61 U$15.P$2 27.04,8.64 v29.21,8.64 | 27.03,10.61 U$21.P$2 U$33.P$2 | 27.03,10.61 25.97,10.61 24.89,11.68 24.88,11.67 U$7.P$4 23.35,11.16 21.59,9.4 13.72,9.4 v12.45,10.67 10.92,10.67 9.47,12.12 U$4.P$1 9.63,13.96 U$8.P$2 U$17.P$2 U$51.P$2 U$16.P$2 | v43.69,6.6 43.69,2.64 J1.10 | U$6.P$2 23.72,39.52 23.62,39.62 23.62,43.43 v23.88,43.69 | 12.17,33.78 U$2.P$26 13.31,33.17 14.22,32.26 v14.73,32.26 | 12.17,33.78 U$2.P$25 | 60.13,16.83 U$1.P$3 60.13,18.52 60.02,18.62 | 60.02,18.62 U$41.P$2 59.95,18.29 59.69,18.29 58.53,17.13 U$1.P$5 | v37.34,32 37.34,31.69 36.16,30.51 U$63.P$2 U$36.P$2 34.63,23.12 U$44.P$2 33.43,22.96 v33.27,23.11 | v56.13,34.54 C2.1 C1.1 61.21,30.06 61.21,19.3 60.53,18.62 60.02,18.62 | v27.69,23.11 v17.27,23.11 | U$3.P$5 5.62,37.58 6.6,37.58 | 6.6,37.58 U$49.P$2 | U$20.P$2 10.74,39.4 11.18,38.97 11.18,38.61 11.42,38.37 | 11.42,38.37 U$2.P$18 | 11.42,38.37 11.42,36.76 | 11.42,36.76 11.76,36.42 U$2.P$21 | 11.42,36.76 11.18,36.52 11.18,34.04 | 11.18,34.04 11.43,33.78 12.17,33.78 | 11.18,34.04 8.64,34.04 6.6,36.07 6.6,37.58
  Bottom 0.254: J1.9 J1.10 | v29.21,8.64 42.42,8.64 43.69,7.37 v43.69,6.6 | 27.43,43.69 29.74,46 29.74,49.63 J2.16 | v14.73,37.59 v14.73,32.26 17.27,29.72 v17.27,23.11 17.27,11.43 16.51,10.67 v12.45,10.67 8.58,10.67 U$5.P$3 6.6,8.69 6.6,7.54 U$5.P$2 | v23.88,43.69 27.43,43.69 | 27.43,43.69 37.34,33.78 v37.34,32 50.04,32 50.55,32.51 | 50.55,32.51 50.8,32.51 | 50.55,32.51 52.58,34.54 v56.13,34.54 | v33.27,23.11 v27.69,23.11
N$1
  Top 0.254: U$1.P$7 56.93,20.64 R1.2 57.52,22.94 60.13,25.55 U$57.P$2 60.13,27.84 58.35,29.62 58.35,31.09 C1.2
N$2
  Top 0.254: U$5.P$1 13.43,4.89 U$12.P$1
N$3
  Top 0.254: U$46.P$2 7.97,45.05 5.93,43.01 U$3.P$6 4.69,43.04 | U$3.P$8 4.26,43.46 4.69,43.04 | U$3.P$9 4.42,35.86 U$3.P$7 3.56,37.32 3.56,42.42 4.18,43.04 4.69,43.04
N$4
  Top 0.254: U$1.P$8 56.13,20.92 R1.1 55.82,22.94 54.73,24.03 U$57.P$1 54.73,28.09 56.25,29.62 56.25,31.03 C2.2
N$5  (via drill 0.35)
  Top 0.254: U$20.P$7 U$20.P$8 8.75,36.69 v8.64,36.58 | v16.26,12.45 16.26,11.94 18.03,10.16 21.05,10.16 22.05,11.16 U$7.P$2
  Bottom 0.254: v8.64,36.58 8.64,25.4 16.26,17.78 v16.26,12.45
N$6  (via drill 0.35)
  Top 0.254: U$9.P$2 20.41,40.48 v20.32,40.39 | v19.56,12.45 20.62,12.45 U$7.P$1
  Bottom 0.254: v20.32,40.39 26.42,34.29 26.42,19.3 v19.56,12.45
N$7
  Top 0.254: U$29.P$1 32.41,35.03 32.77,34.67 32.77,34.29 33.05,34.01 U$48.P$2
N$8
  Top 0.254: U$9.P$3 22.31,39.66 23.4,38.57 U$6.P$3 25.62,38.57 26.16,39.12 26.16,39.88 25.57,40.47 U$6.P$1
N$9
  Top 0.254: U$48.P$3 34.18,33.53 32.77,33.53 32.49,33.25 U$30.P$1
N$10
  Top 0.254: U$63.P$1 33.13,31.36 33.78,32 35.05,32 35.7,32.65 U$48.P$5
N$11
  Top 0.254: U$20.P$3 11.2,39.9 11.62,40.32 U$2.P$15
N$12  (via drill 0.35)
  Top 0.254: U$2.P$5 20.14,34.47 v20.32,34.29 | v25.23,32.62 27.07,32.62 28.82,30.87 U$34.P$5
  Bottom 0.254: v25.23,32.62 21.99,32.62 v20.32,34.29
N$13  (via drill 0.35)
  Top 0.254: U$2.P$1 20.57,31.87 v20.57,31.75 | U$34.P$6 28.17,28.22 27.69,28.7 27.69,29.72 v25.65,31.75
  Bottom 0.254: v25.65,31.75 v20.57,31.75
N$14
  Top 0.254: U$2.P$22 12.2,35.79 13,35.79 18.31,30.48 22.1,30.48 24.89,33.27 28.59,33.27 U$30.P$2
N$15
  Top 0.254: U$20.P$4 10.74,40.89 12.7,40.89 13.46,40.13 13.46,39.88 13.21,39.62 12.22,39.62 U$2.P$16
N$16
  Top 0.254: U$2.P$13 19.77,39.67 23.5,35.94 24.41,35.03 U$29.P$2
N$24
  Top 0.254: U$34.P$1 U$34.P$2 31.59,26.44 U$36.P$1
N$32  (via drill 0.35)
  Top 0.254: 4.89,40.96 U$3.P$1 5.9,40.96 v6.11,41.17 | v12.19,44.2 13.43,44.2 U$47.P$1
  Bottom 0.254: v6.11,41.17 6.11,42.18 8.13,44.2 v12.19,44.2
N$60
  Top 0.254: U$7.P$7 22.05,15.29 22.35,14.99 23.11,14.99 23.35,15.22 U$7.P$5 23.43,16.07 29.46,22.1 29.46,29.21 30.48,30.23 31.33,30.23 32.64,31.54 32.73,31.54 U$48.P$4
RESET  (via drill 0.35)
  Top 0.254: S1.3 S1.4 11.47,51.22 U$60.P$1 12.18,50.5 U$59.P$2 13.68,47.12 v21.21,47.12 21.59,47.12 U$48.P$1 | 64.52,11.94 64.37,12.08 U$1.P$29 57.3,12.08 v56.9,11.68 | v35.77,10.62 J1.13 | J1.13 | v40.64,25.65 40.64,31.24 v24.89,46.99
  Bottom 0.254: v56.9,11.68 54.31,9.1 37.29,9.1 v35.77,10.62 40.64,15.49 v40.64,25.65 | v24.89,46.99 21.33,46.99 v21.21,47.12
RXD  (via drill 0.35)
  Top 0.254: U$1.P$30 64.7,12.88 66.32,14.5 66.32,26.92 | 66.32,26.92 J2.1 | U$34.P$3 31.6,28.22 v31.75,28.37 | v65.53,27.69 65.56,27.69 66.32,26.92
  Bottom 0.254: v31.75,28.37 64.85,28.37 v65.53,27.69
TXD  (via drill 0.35)
  Top 0.254: U$1.P$31 63.98,13.68 64.77,14.48 64.77,30.48 | 64.77,30.48 64.77,50.16 J2.2 | U$34.P$4 31.17,28.72 31.48,29.03 31.5,29.03 v31.75,29.28 | v65.53,29.72 64.77,30.48
  Bottom 0.254: v31.75,29.28 65.09,29.28 v65.53,29.72
VCC_USB
  Top 0.254: U$47.P$2 21.19,44.35 U$9.P$1
VIN  (via drill 0.35)
  Top 0.254: J1.8 48.47,3.6 v45.47,6.6 | v29.21,5.33 28.34,5.33 U$15.P$1 27.03,5.49 18.54,5.49 U$12.P$2 18.28,6.1 15.75,8.64 11.68,8.64 6.6,13.72 6.6,17.53 7.48,18.4 U$4.P$3 9.47,32.08 v9.91,32.51 | U$20.P$1 10,38.65 10,36.63 v10.05,36.58
  Bottom 0.254: v29.21,5.33 29.36,5.49 44.55,5.49 45.47,6.4 v45.47,6.6 | v9.91,32.51 10.05,32.66 v10.05,36.58